# EAGLE schematic ESP32_minimal (EAGLE 9.5.2)
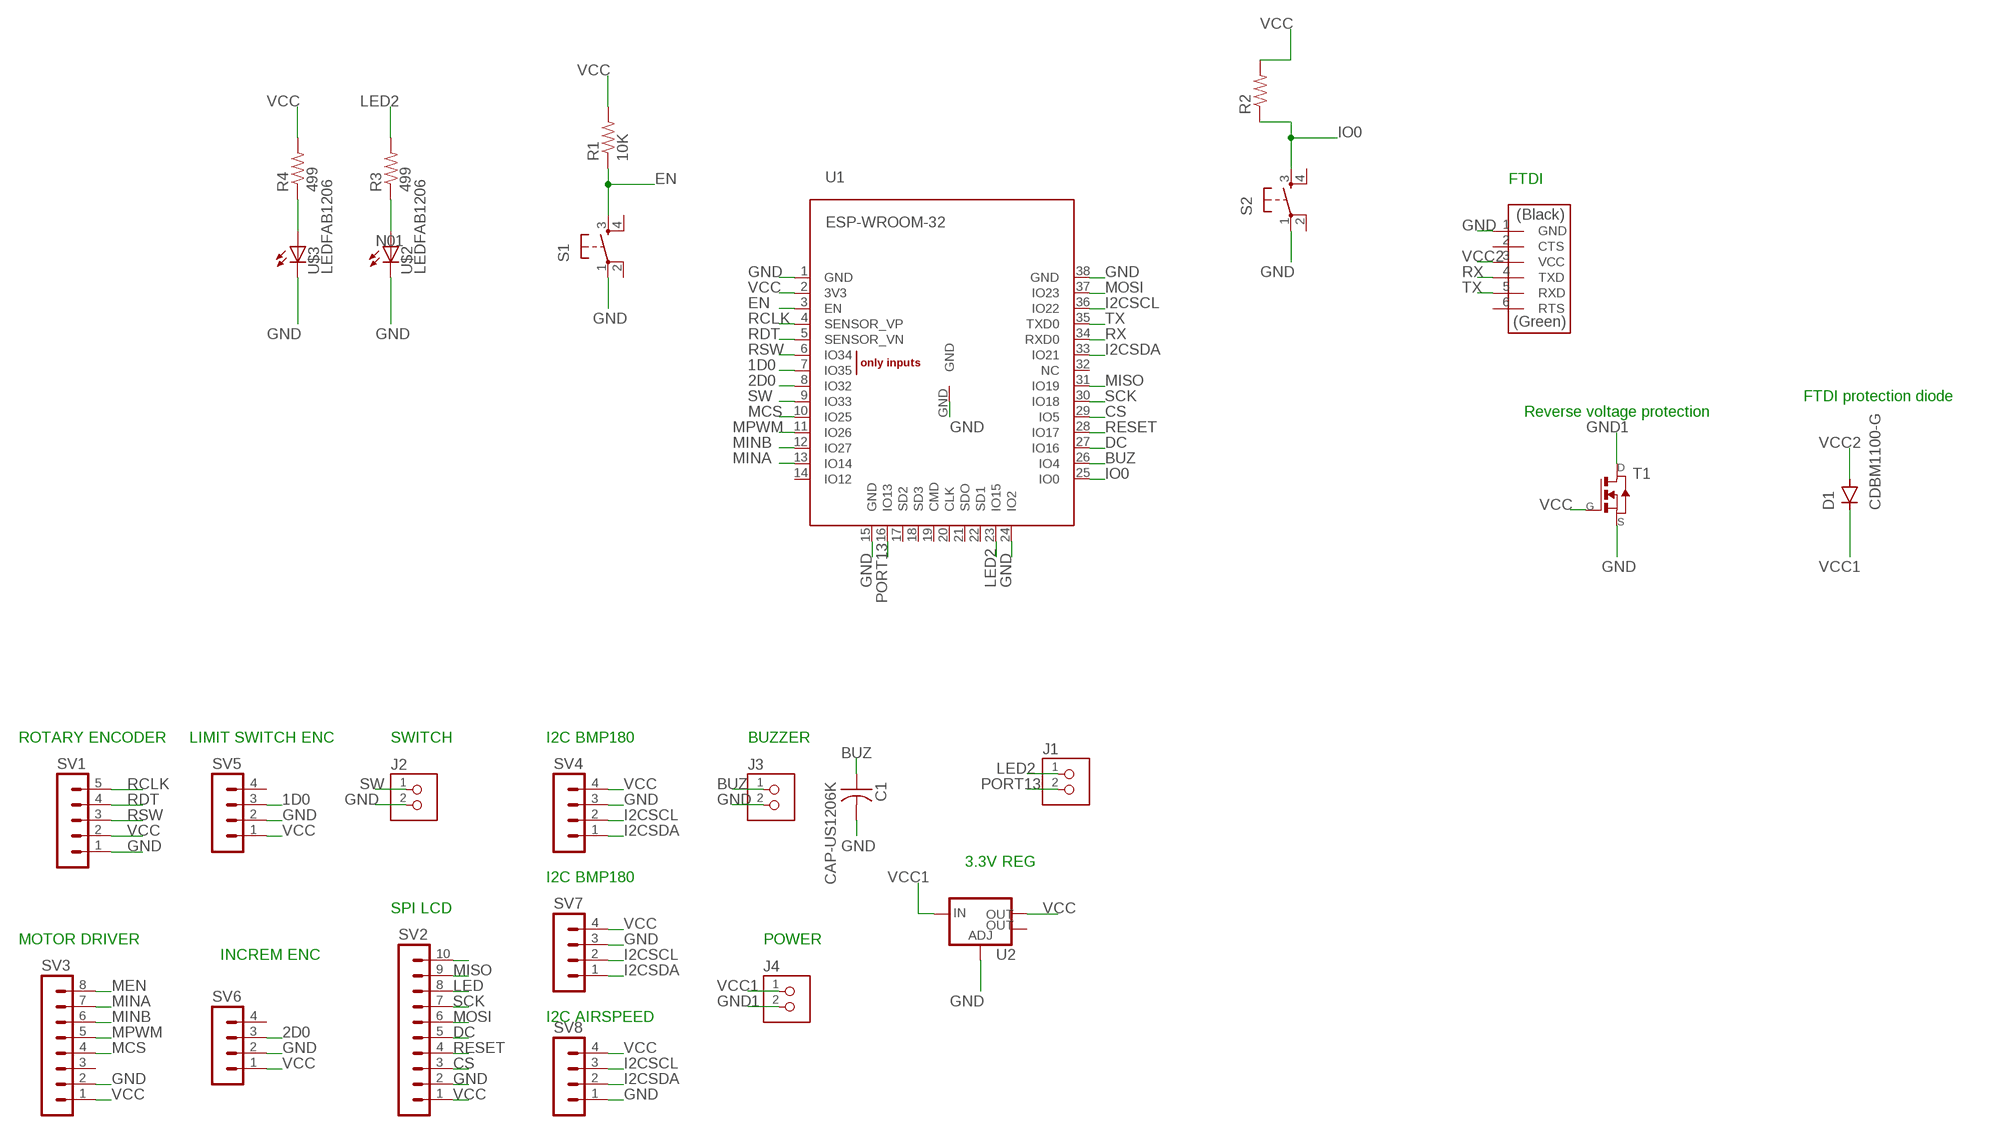
[diagram p0: schematic, sheet 1]

## Parts
C1  CAP-US1206K  [C1206K]
D1  CDBM1100-G  [MINI-SMA]
J1  TERM-1X02-ADAFRUIT  [3.5MMTERM]
J2  TERM-1X02-ADAFRUIT  [3.5MMTERM]
J3  TERM-1X02-ADAFRUIT  [3.5MMTERM]
J4  TERM-1X02-ADAFRUIT  [3.5MMTERM]
R1  10K  RES-US1206FAB  [R1206FAB]
R2  RES-US1206FAB  [R1206FAB]
R3  499  RES-US1206FAB  [R1206FAB]
R4  499  RES-US1206FAB  [R1206FAB]
S1  6MM_SWITCH6MM_SWITCH  [6MM_SWITCH]
S2  6MM_SWITCH6MM_SWITCH  [6MM_SWITCH]
SV1  MAR05-1  [MAR05-1]
SV2  MA10-1  [MA10-1]
SV3  MA08-1  [MA08-1]
SV4  MA04-1  [MA04-1]
SV5  MA04-1  [MA04-1]
SV6  MA04-1  [MA04-1]
SV7  MA04-1  [MA04-1]
SV8  MA04-1  [MA04-1]
T1  NMOSFETSOT23  [SOT-23]
U1  ESP-WROOM-32  [ESP-WROOM-32]
U2  V_REG_LM1117SOT223  [SOT223]
U$1  FTDI-SMD-HEADER  [1X06SMD]
U$2  LEDFAB1206  [LED1206FAB]
U$3  LEDFAB1206  [LED1206FAB]

## Nets
1D0: SV5.3 U1.7(IO35)
2D0: SV6.3 U1.8(IO32)
BUZ: C1.1 J3.1 U1.26(IO4)
CS: SV2.3 U1.29(IO5)
DC: SV2.5 U1.27(IO16)
EN: R1.1 S1.3(S) U1.3(EN)
GND: C1.2 J2.2 J3.2 S1.1(P) S2.1(P) SV1.1 SV2.2 SV3.2 SV4.3 SV5.2 SV6.2 SV7.3 SV8.1 T1.2(S) U1.1(GND) U1.15(GND) U1.24(IO2) U1.38(GND) U1.GND U2.1(ADJ) U$1.1(GND) U$2.2(C) U$3.2(C)
GND1: J4.2 T1.1(D)
I2CSCL: SV4.2 SV7.2 SV8.3 U1.36(IO22)
I2CSDA: SV4.1 SV7.1 SV8.2 U1.33(IO21)
IO0: R2.1 S2.3(S) U1.25(IO0)
LED: SV2.8
LED2: J1.1 R3.2 U1.23(IO15)
MCS: SV3.4 U1.10(IO25)
MEN: SV3.8
MINA: SV3.7 U1.13(IO14)
MINB: SV3.6 U1.12(IO27)
MISO: SV2.9 U1.31(IO19)
MOSI: SV2.6 U1.37(IO23)
MPWM: SV3.5 U1.11(IO26)
N01: R3.1 U$2.1(A)
N$1: R4.1 U$3.1(A)
N$11: SV2.10
PORT13: J1.2 U1.16(IO13)
RCLK: SV1.5 U1.4(SENSOR_VP)
RDT: SV1.4 U1.5(SENSOR_VN)
RESET: SV2.4 U1.28(IO17)
RSW: SV1.3 U1.6(IO34)
RX: U1.34(RXD0) U$1.4(TXD)
SCK: SV2.7 U1.30(IO18)
SW: J2.1 U1.9(IO33)
TX: U1.35(TXD0) U$1.5(RXD)
VCC: R1.2 R2.2 R4.2 SV1.2 SV2.1 SV3.1 SV4.4 SV5.1 SV6.1 SV7.4 SV8.4 T1.3(G) U1.2(3V3) U2.2(OUT)
VCC1: D1.KATHODE J4.1 U2.3(IN)
VCC2: D1.ANODE U$1.3(VCC)
Unconnected: S1.2(P1) S1.4(S1) S2.2(P1) S2.4(S1) SV3.3 SV5.4 SV6.4 U1.14(IO12) U1.17(SD2) U1.18(SD3) U1.19(CMD) U1.20(CLK) U1.21(SDO) U1.22(SD1) U1.32(NC) U2.4(OUT) U$1.2(CTS) U$1.6(RTS)

## Notes on the sheet
- FTDI
- FTDI protection diode
- Reverse voltage protection
- ROTARY ENCODER | LIMIT SWITCH ENC | SWITCH | I2C BMP180 | BUZZER
- 3.3V REG
- I2C BMP180
- SPI LCD
- MOTOR DRIVER | POWER
- INCREM ENC
- I2C AIRSPEED

## Library data of the parts
C1 = fab:CAP-US
D1 = fab:CDBM1100-G: Diode schottky 100V 1A mini-SMA as found in the fablab inventory Reverse Voltage: 100 Volts Forward Current: 1.0 Amp Maximum forward voltage: 0.85 Volts Made by Zaerc.
J1-J4 = fab:TERM-1X02: 3.5mm terminal block, 2 positions ED555-2DS as found in the fablab inventory. Stolen from Adafruit <http://www.ladyada.net/library/pcb/eaglelibrary.html>, adapted by Zaerc.
R1-R4 = fab:RES-US: Resistor (US Symbol) Variants with postfix FAB are widened to allow the routing of internal traces
S1 S2 = fab:6MM_SWITCH: OMRON SWITCH
SV1 = con-lstb:MAR05-1: PIN HEADER; OC_FARNELL: unknown; OC_NEWARK: unknown
SV2 = con-lstb:MA10-1: PIN HEADER; OC_FARNELL: unknown; OC_NEWARK: unknown
SV3 = con-lstb:MA08-1: PIN HEADER; OC_FARNELL: unknown; OC_NEWARK: unknown
SV4-SV8 = con-lstb:MA04-1: PIN HEADER; OC_FARNELL: unknown; OC_NEWARK: unknown
T1 = fab:NMOSFET: MOS FET
U1 = esp32:ESP-WROOM-32
U2 = fab:V_REG_LM1117: Voltage Regulator LM1117 Standard adjustable voltage regulator but in SMD form. Spark Fun Electronics SKU : COM-00595; PROD_ID: VREG-08170
U$1 = fab:FTDI-SMD-HEADER
U$2 U$3 = fab:LED: LED